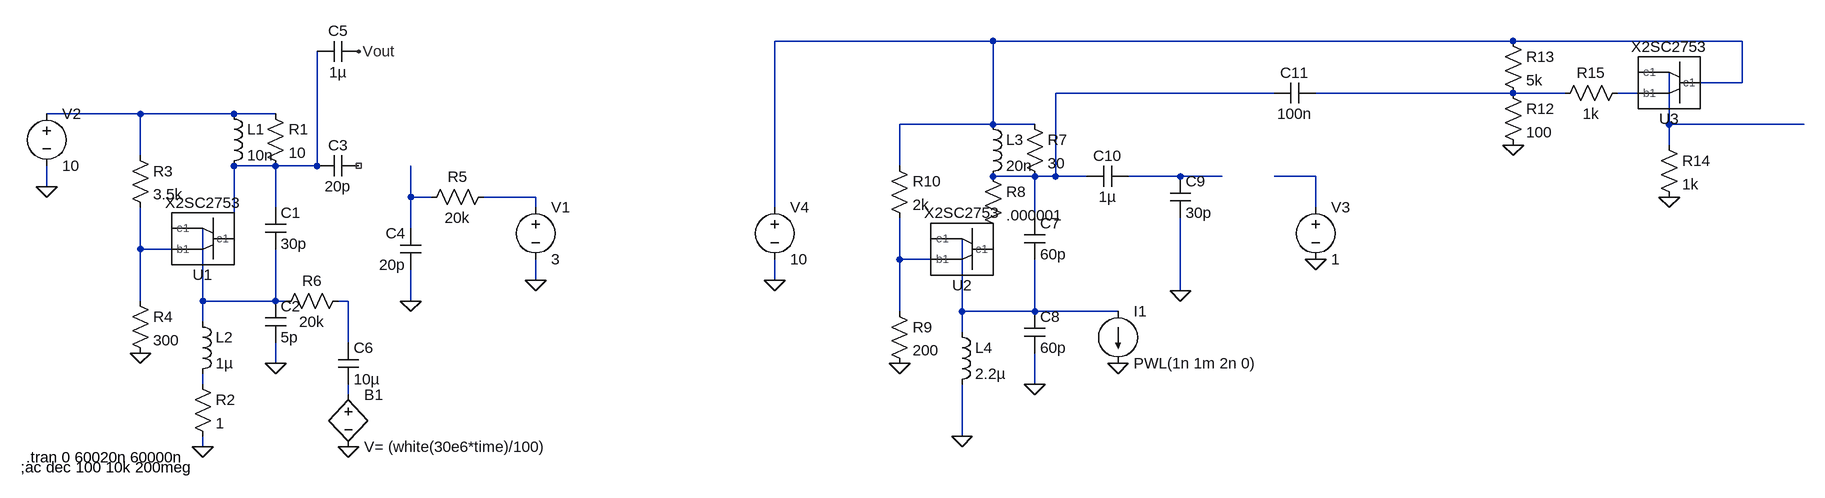
[diagram p0: schematic Oscillator - Copy.asc]
Oscillator - Copy.asc, the LTspice schematic file:
Version 4
SHEET 1 2276 680
WIRE 1024 -176 688 -176
WIRE 1824 -176 1024 -176
WIRE 2176 -176 1824 -176
WIRE 2064 -128 2016 -128
WIRE 2176 -112 2176 -176
WIRE 2176 -112 2112 -112
WIRE 1456 -96 1120 -96
WIRE 1824 -96 1520 -96
WIRE 1904 -96 1824 -96
WIRE 2016 -96 1984 -96
WIRE -288 -64 -432 -64
WIRE -144 -64 -288 -64
WIRE -80 -64 -144 -64
WIRE 1024 -48 1024 -176
WIRE 1024 -48 880 -48
WIRE 1088 -48 1024 -48
WIRE 2064 -48 2064 -128
WIRE 2272 -48 2064 -48
WIRE 2064 -16 2064 -48
WIRE -288 0 -288 -64
WIRE -80 16 -144 16
WIRE -16 16 -16 -160
WIRE -16 16 -80 16
WIRE 880 16 880 -48
WIRE 1088 32 1024 32
WIRE 1120 32 1120 -96
WIRE 1120 32 1088 32
WIRE 1168 32 1120 32
WIRE 1312 32 1232 32
WIRE 1376 32 1312 32
WIRE 1520 32 1456 32
WIRE -432 48 -432 16
WIRE 128 64 128 16
WIRE 160 64 128 64
WIRE 320 64 240 64
WIRE -80 80 -80 16
WIRE 320 80 320 64
WIRE 688 80 688 -176
WIRE 1520 80 1520 32
WIRE 1088 96 1088 32
WIRE -192 112 -240 112
WIRE 128 112 128 64
WIRE -144 128 -144 16
WIRE 976 128 928 128
WIRE -288 144 -288 80
WIRE -240 144 -288 144
WIRE 1024 144 1024 112
WIRE 880 160 880 96
WIRE 928 160 880 160
WIRE 320 192 320 160
WIRE 688 192 688 160
WIRE 1312 208 1312 96
WIRE -288 224 -288 144
WIRE -192 224 -192 112
WIRE -80 224 -80 144
WIRE -80 224 -192 224
WIRE -64 224 -80 224
WIRE 32 224 16 224
WIRE 128 224 128 176
WIRE 880 240 880 160
WIRE 976 240 976 128
WIRE 1088 240 1088 160
WIRE 1088 240 976 240
WIRE 1216 240 1088 240
WIRE -192 256 -192 224
WIRE 976 272 976 240
WIRE 32 288 32 224
WIRE -80 320 -80 288
WIRE -192 352 -192 336
WIRE 1088 352 1088 304
WIRE 32 368 32 352
WIRE 976 432 976 352
WIRE -192 448 -192 432
FLAG -192 448 0
FLAG -80 320 0
FLAG 128 224 0
FLAG 320 192 0
FLAG -432 48 0
FLAG 48 -160 Vout
FLAG -288 304 0
FLAG 32 448 0
FLAG 688 192 0
FLAG 880 320 0
FLAG 1216 320 0
FLAG 976 432 0
FLAG 1088 352 0
FLAG 1520 160 0
FLAG 1824 -16 0
FLAG 2064 64 0
FLAG 1312 208 0
DATAFLAG -16 -32 ""
DATAFLAG 2144 -48 ""
SYMBOL AutoGenerated\\X2SC2753 -192 128 R180
SYMATTR InstName U1
SYMBOL ind -160 -80 R0
SYMATTR InstName L1
SYMATTR Value 10n
SYMBOL res -96 -80 R0
SYMATTR InstName R1
SYMATTR Value 10
SYMBOL ind -208 240 R0
SYMATTR InstName L2
SYMATTR Value 1µ
SYMBOL res -208 336 R0
SYMATTR InstName R2
SYMATTR Value 1
SYMBOL res -304 208 R0
SYMATTR InstName R4
SYMATTR Value 300
SYMBOL res -304 -16 R0
SYMATTR InstName R3
SYMATTR Value 3.5k
SYMBOL cap -96 80 R0
SYMATTR InstName C1
SYMATTR Value 30p
SYMBOL cap -96 224 R0
SYMATTR InstName C2
SYMATTR Value 5p
SYMBOL cap 48 0 R90
WINDOW 0 0 32 VBottom 2
WINDOW 3 32 32 VTop 2
SYMATTR InstName C3
SYMATTR Value 20p
SYMBOL cap 144 176 R180
WINDOW 0 24 56 Left 2
WINDOW 3 24 8 Left 2
SYMATTR InstName C4
SYMATTR Value 20p
SYMBOL res 256 48 R90
WINDOW 0 0 56 VBottom 2
WINDOW 3 32 56 VTop 2
SYMATTR InstName R5
SYMATTR Value 20k
SYMBOL voltage 320 64 R0
WINDOW 123 0 0 Left 0
WINDOW 39 0 0 Left 0
SYMATTR InstName V1
SYMATTR Value 3
SYMBOL voltage -432 -80 R0
WINDOW 123 0 0 Left 0
WINDOW 39 0 0 Left 0
SYMATTR InstName V2
SYMATTR Value 10
SYMBOL cap 48 -176 R90
WINDOW 0 0 32 VBottom 2
WINDOW 3 32 32 VTop 2
SYMATTR InstName C5
SYMATTR Value 1µ
SYMBOL bv 32 352 R0
SYMATTR InstName B1
SYMATTR Value V= (white(30e6*time)/100)
SYMBOL cap 16 288 R0
SYMATTR InstName C6
SYMATTR Value 10µ
SYMBOL res 32 208 R90
WINDOW 0 0 56 VBottom 2
WINDOW 3 32 56 VTop 2
SYMATTR InstName R6
SYMATTR Value 20k
SYMBOL AutoGenerated\\X2SC2753 976 144 R180
SYMATTR InstName U2
SYMBOL ind 1008 -64 R0
SYMATTR InstName L3
SYMATTR Value 20n
SYMBOL res 1072 -64 R0
SYMATTR InstName R7
SYMATTR Value 30
SYMBOL res 864 224 R0
SYMATTR InstName R9
SYMATTR Value 200
SYMBOL res 864 0 R0
SYMATTR InstName R10
SYMATTR Value 2k
SYMBOL cap 1072 96 R0
SYMATTR InstName C7
SYMATTR Value 60p
SYMBOL cap 1072 240 R0
SYMATTR InstName C8
SYMATTR Value 60p
SYMBOL voltage 688 64 R0
WINDOW 123 0 0 Left 0
WINDOW 39 0 0 Left 0
SYMATTR InstName V4
SYMATTR Value 10
SYMBOL ind 960 256 R0
SYMATTR InstName L4
SYMATTR Value 2.2µ
SYMBOL res 1008 16 R0
SYMATTR InstName R8
SYMATTR Value .000001
SYMBOL current 1216 240 R0
WINDOW 123 0 0 Left 0
WINDOW 39 0 0 Left 0
SYMATTR InstName I1
SYMATTR Value PWL(1n 1m 2n 0)
SYMBOL cap 1296 32 R0
SYMATTR InstName C9
SYMATTR Value 30p
SYMBOL cap 1232 16 R90
WINDOW 0 0 32 VBottom 2
WINDOW 3 32 32 VTop 2
SYMATTR InstName C10
SYMATTR Value 1µ
SYMBOL voltage 1520 64 R0
WINDOW 123 0 0 Left 0
WINDOW 39 0 0 Left 0
SYMATTR InstName V3
SYMATTR Value 1
SYMBOL cap 1520 -112 R90
WINDOW 0 0 32 VBottom 2
WINDOW 3 32 32 VTop 2
SYMATTR InstName C11
SYMATTR Value 100n
SYMBOL res 1808 -112 R0
SYMATTR InstName R12
SYMATTR Value 100
SYMBOL res 1808 -192 R0
SYMATTR InstName R13
SYMATTR Value 5k
SYMBOL AutoGenerated\\X2SC2753 2064 -112 R180
SYMATTR InstName U3
SYMBOL res 2048 -32 R0
SYMATTR InstName R14
SYMATTR Value 1k
SYMBOL res 2000 -112 R90
WINDOW 0 0 56 VBottom 2
WINDOW 3 32 56 VTop 2
SYMATTR InstName R15
SYMATTR Value 1k
TEXT -464 464 Left 2 !.tran 0 60020n 60000n
TEXT -472 480 Left 2 !;ac dec 100 10k 200meg

The netlist it stands for:
* Oscillator - Copy.asc
XU1 N007 N014 N012 X2SC2753  ; pins c1 b1 e1
L1 N006 N007 10n
R1 N006 N007 10
L2 N012 N018 1µ
R2 N018 0 1
R4 N014 0 300
R3 N006 N014 3.5k
C1 N007 N012 30p
C2 N012 0 5p
C3 NC_01 N007 20p
C4 0 N010 20p
R5 N011 N010 20k
V1 N011 0 3
V2 N006 0 10
C5 Vout N007 1µ
B1 N019 0 V= (white(30e6*time)/100)
C6 N017 N019 10µ
R6 N017 N012 20k
XU2 N015 N016 N013 X2SC2753  ; pins c1 b1 e1
L3 N001 N003 20n
R7 N001 N003 30
R9 N016 0 200
R10 N001 N016 2k
C7 N003 N013 60p
C8 N013 0 60p
V4 N001 0 10
L4 N013 0 2.2µ
R8 N003 N015 .000001
I1 N013 0 PWL(1n 1m 2n 0)
C9 N008 0 30p
C10 N008 N003 1µ
V3 N009 0 1
C11 N004 N003 100n
R12 N004 0 100
R13 N001 N004 5k
XU3 N001 N005 N002 X2SC2753  ; pins c1 b1 e1
R14 N002 0 1k
R15 N005 N004 1k
.tran 0 60020n 60000n
;ac dec 100 10k 200meg
.lib C:/Users/jonathansharir-smith/Desktop/251SPICE/Lab2/narrowband\2SC2753.lib
.backanno
.end